# Altium schematic sheet Sheet3.SchDoc
size A; SheetNumber: 1; SheetTotal: 1
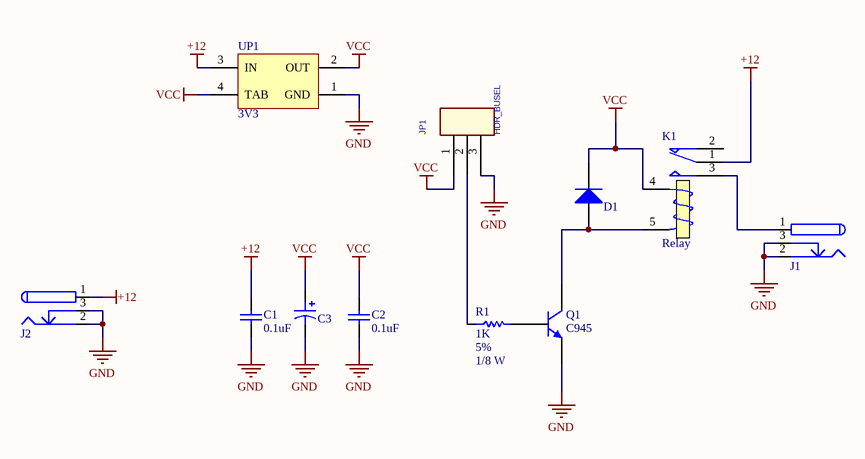
[diagram p0: Sheet3.SchDoc]

## Parts
C1  0.1uF  [CAPC4817X12N]
C2  0.1uF  [CAPC4817X12N]
C3  100uF50V  [Cap electrolitic radial 6x7-2.5]  (value not drawn)
D1  1n4007  [DIOM4629X24N]  (value not drawn)
J1  DC Power Jack  [DC Power Jack 1]  (value not drawn)
J2  DC Power Jack  [DC Power Jack 1]  (value not drawn)
JP1  HDR_BUSEL  [HDR_1x3]
K1  Relay  [Relay 15.40x12.10x13.10]
Q1  C945  [SOT23_N]
R1  Tolerance: 5%  Power: 1/8 W  [Res-(1/4)]  (hidden comment: 1K)
UP1  3V3  [SOT223_N]

## Nets
+12: C1.2 J2.1 K1.1(COM) UP1.3(IN)
GND: C1.1 C2.1 C3.2 J1.2 J1.3 J2.2 J2.3 JP1.3 Q1.2(E) UP1.1(GND)
VCC: C2.2 C3.1 D1.2(K) JP1.1 K1.4(T1) UP1.2(OUT) UP1.4(TAB)
NetD1_1: D1.1(A) K1.5(T2) Q1.3(C)
NetJ1_1: J1.1 K1.3(NO)
NetJP1_2: JP1.2 R1.1
NetQ1_1: Q1.1(B) R1.2

Not connected (* = marked no-connect by the designer): K1 2(NC)

## Library data of the parts
C1 C2 = CAP SMD 1206: CAP 1206; Designer: Abbas Basereh; Desc.: CAP SMD 1206; Data: 16-12-2016
C3 = Cap ELECTROLITIC TOTAL SIZE: Cap electrolitic radial; Designer: Abbas Basereh; Data: 16-12-2016; Part. No: *; VALUE: 100uF50V
D1 = 1n4007 SMD M7: Standard Rectifiers; Part. No: M7; Manufacturer: DC COMPONENTS; Designer: Abbas Basereh; Link: http://www.tme.eu/en/details/m7/smd-universal-diodes/dc-components/; Link: https://www.aliexpress.com/item/Smd-tube-1n4007-m7-SMA/1213719741.html?spm=2114.01010208.3.1.ZyZ7bC&ws_ab_test=searchweb0_0,searchweb201602_4_10065_10068_10084_10083_10080_10082_10081_10060_10061_10062_10056_10055_10054_10059_10099_10078_10079_427_10073_10103_10102_10096_10052_10050_10051,searchweb201603_4&btsid=db2be5ca-e560-400a-b91c-484ab5ee228b; Data: 16-12-2016
J1 J2 = DC Power Jack: DC Power Jack. Center Pin 2.5mm. Diameter: 5.7mm; Designer: Ali Hafizi; Company: Personal; Project Name: Laser; Adding Date: 10/21/2009
JP1 = Header 1x3: header or jumper box
K1 = Relay: SPDT Relay; Designer: Eng. Saeid Jorablo; Company: E.P.I.L; Design_Date: 2011/10/31
Q1 = C945: NPN Silicon Epitaxial Planar Transistor; Published: 2017-2-8; LatestRevisionDate: 2017; LatestRevisionNote: IPC-7351 Footprint Added.; DatasheetVersion: 2017; PackageVersion: 2017-2-8; PackageReference: SOT23; Publisher: Abbas Basereh; PackageDescription: 3-Pin SOT-23 Package 0.95 mm Pitch, 2.3 mm Lead Span; ComponentLink1Description: Manufacturer Link; ComponentLink1URL: http://www.taitroncomponents.com/; ComponentLink2Description: Datasheet; ComponentLink2URL: http://www.taitroncomponents.com/
R1 = Resistor: Value: 1K
UP1 = AMS1117-x.x: x.x Volt, 800mA Low-Dropout Linear Regulator, 4-pin SOT-223; Designer: Ali Hafizi; Data: 16-12-2016